# Altium schematic sheet HalfeBridge.SchDoc
size A4
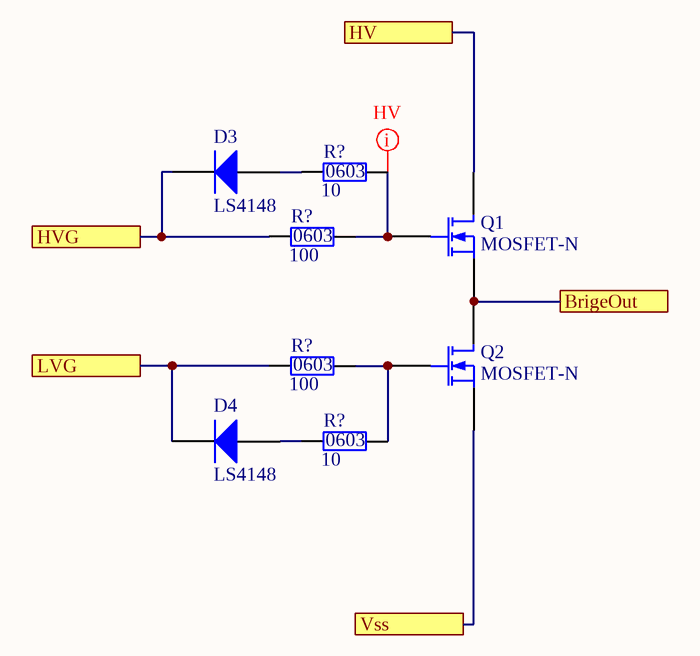
[diagram p0: HalfeBridge.SchDoc]

## Parts
(Parts that share a designator on the sheet are numbered #1, #2 ... from top to bottom, then left to right.)
D3  LS4148  [SOD-80]
D4  LS4148  [SOD-80]
Q1  MOSFET-N  [D2PAK_N]
Q2  MOSFET-N  [D2PAK_N]
R?#1  0603  value 10  [1608[0603]]
R?#2  0603  value 100  [1608[0603]]
R?#3  0603  value 100  [1608[0603]]
R?#4  0603  value 10  [1608[0603]]

## Ports
BrigeOut, HV, HVG, LVG, Vss

## Nets
BrigeOut: Q1.3(S) Q2.2(D) ; port BrigeOut
HV: Q1.2(D) ; port HV
HVG: D3.2(K) R?#2.1 ; port HVG
LVG: D4.2(K) R?#3.1 ; port LVG
Vss: Q2.3(S) ; port Vss
NetD3_1: D3.1(A) R?#1.1
NetD4_1: D4.1(A) R?#4.1
NetQ1_1: Q1.1(G) R?#1.2 R?#2.2
NetQ2_1: Q2.1(G) R?#3.2 R?#4.2

## Layout directives
mark named HV: NetQ1_1

## Library data of the parts
D3 D4 = Diode: Default Diode; Published: 8-Jun-2000; LatestRevisionDate: 17-Jul-2002; LatestRevisionNote: Re-released for DXP Platform.; PackageVersion: Sep-1996; PackageReference: SMC; Publisher: Altium Limited; PackageDescription: DO-214-AB/SMC; 2 C-Bend Leads; Body 7.9 x 5.9 mm, inc. leads (LxW); Code_JEDEC: DO-214-AB
Q1 = MOSFET-N: R6020KNJTL; Published: 8-Jun-2000; LatestRevisionDate: 17-Jul-2002; LatestRevisionNote: Re-released for DXP Platform.; PackageVersion: 1995/1996; PackageReference: E3; Publisher: Altium Limited; PackageDescription: TO, Flat Index; 3 In-Line, Axial Leads; Body Dia. 4.6mm; Lead Dia. 0.5 mm (max); Supplier 1: Mouser; Supplier Part Number 1: 755-R6020KNJTL
Q2 = MOSFET-N: N-Channel MOSFET; Published: 8-Jun-2000; LatestRevisionDate: 17-Jul-2002; LatestRevisionNote: Re-released for DXP Platform.; PackageVersion: 1995/1996; PackageReference: E3; Publisher: Altium Limited; PackageDescription: TO, Flat Index; 3 In-Line, Axial Leads; Body Dia. 4.6mm; Lead Dia. 0.5 mm (max); Supplier 1: Mouser; Supplier Part Number 1: 755-R6020KNJTL
R?#1-R?#4 = Res2: Resistor; Published: 8-Jun-2000; LatestRevisionDate: 17-Jul-2002; LatestRevisionNote: Re-released for DXP Platform.; PackageReference: AXIAL-0.4; Publisher: Altium Limited; PackageDescription: Axial Device, Thru-Hole; 2 Leads; 0.4 in Pin Spacing; Supplier 1: Digi-Key; Supplier Part Number 1: 541-220KFDKR-ND